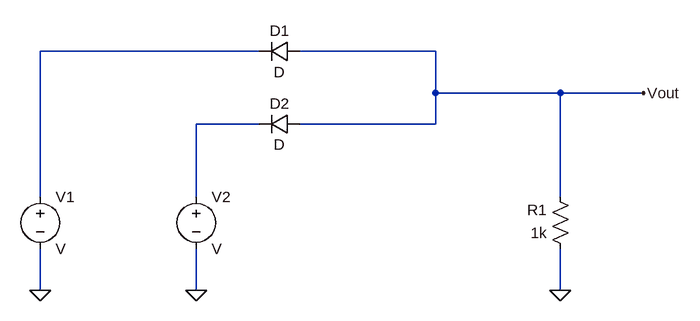
[diagram p0: schematic OR_Gate_Negative.asc]
OR_Gate_Negative.asc, the LTspice schematic file:
Version 4
SHEET 1 880 680
WIRE -32 -48 -368 -48
WIRE 240 -48 32 -48
WIRE 240 16 240 -48
WIRE 432 16 240 16
WIRE 560 16 432 16
WIRE -32 64 -128 64
WIRE 240 64 240 16
WIRE 240 64 32 64
WIRE -368 176 -368 -48
WIRE -128 176 -128 64
WIRE 432 176 432 16
WIRE -368 320 -368 256
WIRE -128 320 -128 256
WIRE 432 320 432 256
FLAG -368 320 0
FLAG -128 320 0
FLAG 432 320 0
FLAG 560 16 Vout
SYMBOL voltage -368 160 R0
SYMATTR InstName V1
SYMBOL voltage -128 160 R0
SYMATTR InstName V2
SYMBOL res 448 272 R180
WINDOW 0 36 76 Left 2
WINDOW 3 36 40 Left 2
SYMATTR InstName R1
SYMATTR Value 1k
SYMBOL diode 32 -64 R90
WINDOW 0 0 32 VBottom 2
WINDOW 3 32 32 VTop 2
SYMATTR InstName D1
SYMBOL diode 32 48 R90
WINDOW 0 0 32 VBottom 2
WINDOW 3 32 32 VTop 2
SYMATTR InstName D2

The netlist it stands for:
* OR_Gate_Negative.asc
V1 N001 0 V
V2 N002 0 V
R1 0 Vout 1k
D1 Vout N001 D
D2 Vout N002 D
.model D D
.lib standard.dio
.backanno
.end